# Altium schematic sheet FLASH.SchDoc
size A2; SheetNumber: 3; SheetTotal: 8
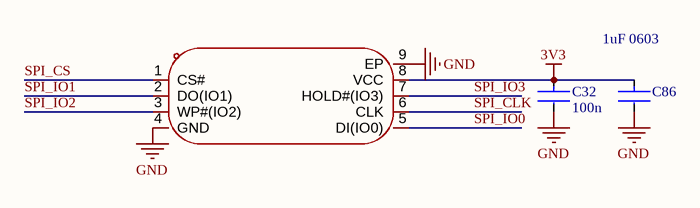
[diagram p0: FLASH.SchDoc]

## Parts
C32  100n  [CAP_0402]
C86  1uF 0603  [FP-GRM188-0_15-MFG]
U16  w25n02kvzeir  [w25n02]  (value not drawn)

## Nets
3V3: C32.1 C86.1 U16.8(VCC)
GND: C32.2 C86.2 U16.4(GND) U16.9(EP)
SPI_CLK: U16.6(CLK)
SPI_CS: U16.1(CS#)
SPI_IO0: U16.5(DI(IO0))
SPI_IO1: U16.2(DO(IO1))
SPI_IO2: U16.3(WP#(IO2))
SPI_IO3: U16.7(HOLD#(IO3))

## Library data of the parts
C32 = CMP-03422-001116-1: C307331; Tolerance: 10%; Voltage Rating: 50V; Capacitance: 100nF; Value: 100nF; Max Operating Temperature: 125°C; Case Code (Metric): 1005; RoHS Compliant: Yes; Series: -; Case Code (Imperial): 0402; Min Operating Temperature: -55°C; Mount: Surface Mount; Case/Package: 0402; Packaging: Cut Tape
C86 = CMP-06035-003612-1: C15849; Tolerance: 20%; Dielectric: X5R; Voltage Rating: 10V; Material: Ceramic; Package Quantity: 4000; Width: 0.8mm; Case/Package: 0603; Thickness: 0.035inch; Capacitance: 1uF; Voltage Rating (DC): 10V; Termination: SMD/SMT; Length: 1.6mm; Lead Free: Lead Free; Mount: Surface Mount; Height: 0.8mm; Depth: 0.8mm; Packaging: Tape and Reel; Weight: 0.000222oz; Min Operating Temperature: -55°C; Case Code (Metric): 1608; Max Operating Temperature: 85°C; Case Code (Imperial): 0603; Value: 1uF
U16 = w25n02kvzeir: C17626844; Manufacturer: Winbond(华邦); AddInBom: yes; ModelId: 9e5cc5bccb2d4d2ba04b587249e4c285; ModelName: WSON-8_L8.0-W6.0-P1.27-TL-EP-1; ModelTransform: 314.96,236.22,0,0,0,0,0,0,0; Memory Size: 2Gbit; Interface: SPI; Clock Frequency: 104MHz; Voltage - Supply: 2.7V~3.6V; Page Program time (TPP): 700us; Block Erase Time(tBE): 2ms; Data Retention - TDR (Year): 10 Years; Standby Supply Current: 10uA; Program / Erase Cycles: 60,000 Cycles; Symbol: W25N02KVZEIR; LCSC Part Name: 支持双路/四路SPI、缓冲读取和顺序读取的SPI NAND闪存; SupplierPart: C3010298; ManufacturerPart: W25N02KVZEIR; Supplier Footprint: WSON-8-EP(6x8); JLCPCB Part Class: Extended Part; Datasheet: https://item.szlcsc.com/datasheet/W25N02KVZEIR/3508597.html; Supplier: LCSC; ConvertToPcb: yes; FootprintName: WSON-8_L8.0-W6.0-P1.27-TL-EP-1; Write Cycle Time(tWC): -; Operating Temperature: -40℃~+85℃